# Altium schematic sheet LedRGB.SchDoc
size A
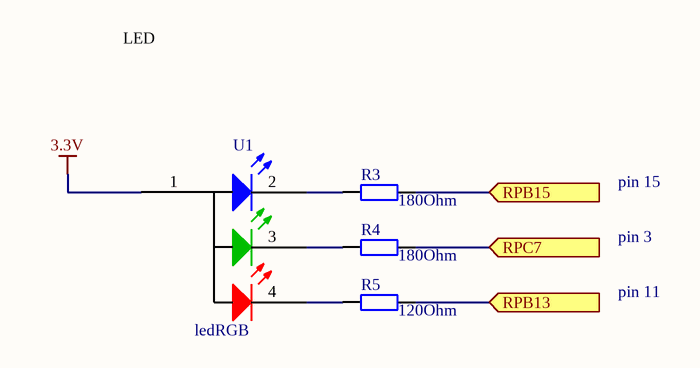
[diagram p0: LedRGB.SchDoc]

## Parts
R3  value 180Ohm  [0603]  (hidden comment: Res2)
R4  value 180Ohm  [0603]  (hidden comment: Res2)
R5  value 120Ohm  [0603]  (hidden comment: Res2)
U1  ledRGB  [LED RGB]

## Ports
RPB13 (in), RPB15 (in), RPC7 (in)

## Nets
3.3V: U1.1
RPB13: R5.2 ; port RPB13
RPB15: R3.2 ; port RPB15
RPC7: R4.2 ; port RPC7
NetR3_1: R3.1 U1.2
NetR4_1: R4.1 U1.3
NetR5_1: R5.1 U1.4

## Notes on the sheet
- LED
- pin 15
- pin 3
- pin 11

## Library data of the parts
R3-R5 = Res2: Resistor; Published: 8-Jun-2000; LatestRevisionDate: 17-Jul-2002; LatestRevisionNote: Re-released for DXP Platform.; PackageReference: AXIAL-0.4; Publisher: Altium Limited; PackageDescription: Axial Device, Thru-Hole; 2 Leads; 0.4 in Pin Spacing
U1 = ledRGB: FABRIQUANT: MIDAS; FOURNISSEUR: FARNELL; REF FABRIQUANT: AMB-MTB0-0A3A2; REF FOURNISSEUR: 2401105